# Altium project Motherboard.PrjPcb (part 2 of 2)

## Sheet USB.SchDoc: Ethernet PHY with RJ45 connector
size A3; Date: Not used; ApprovedBy: Not used; CheckedBy: Not used; Author: Not used; CompanyName: STMicroelectronics; DrawnBy: Not used; Engineer: Not used; Organization: Not used; Address1: Not used; Address2: Not used; Address3: Not used; Address4: Not used; DocumentNumber: 6; Revision: Not used; SheetNumber: 6; SheetTotal: 9; Time: Not used; ImagePath: Not used; Application_BuildNumber: Not used
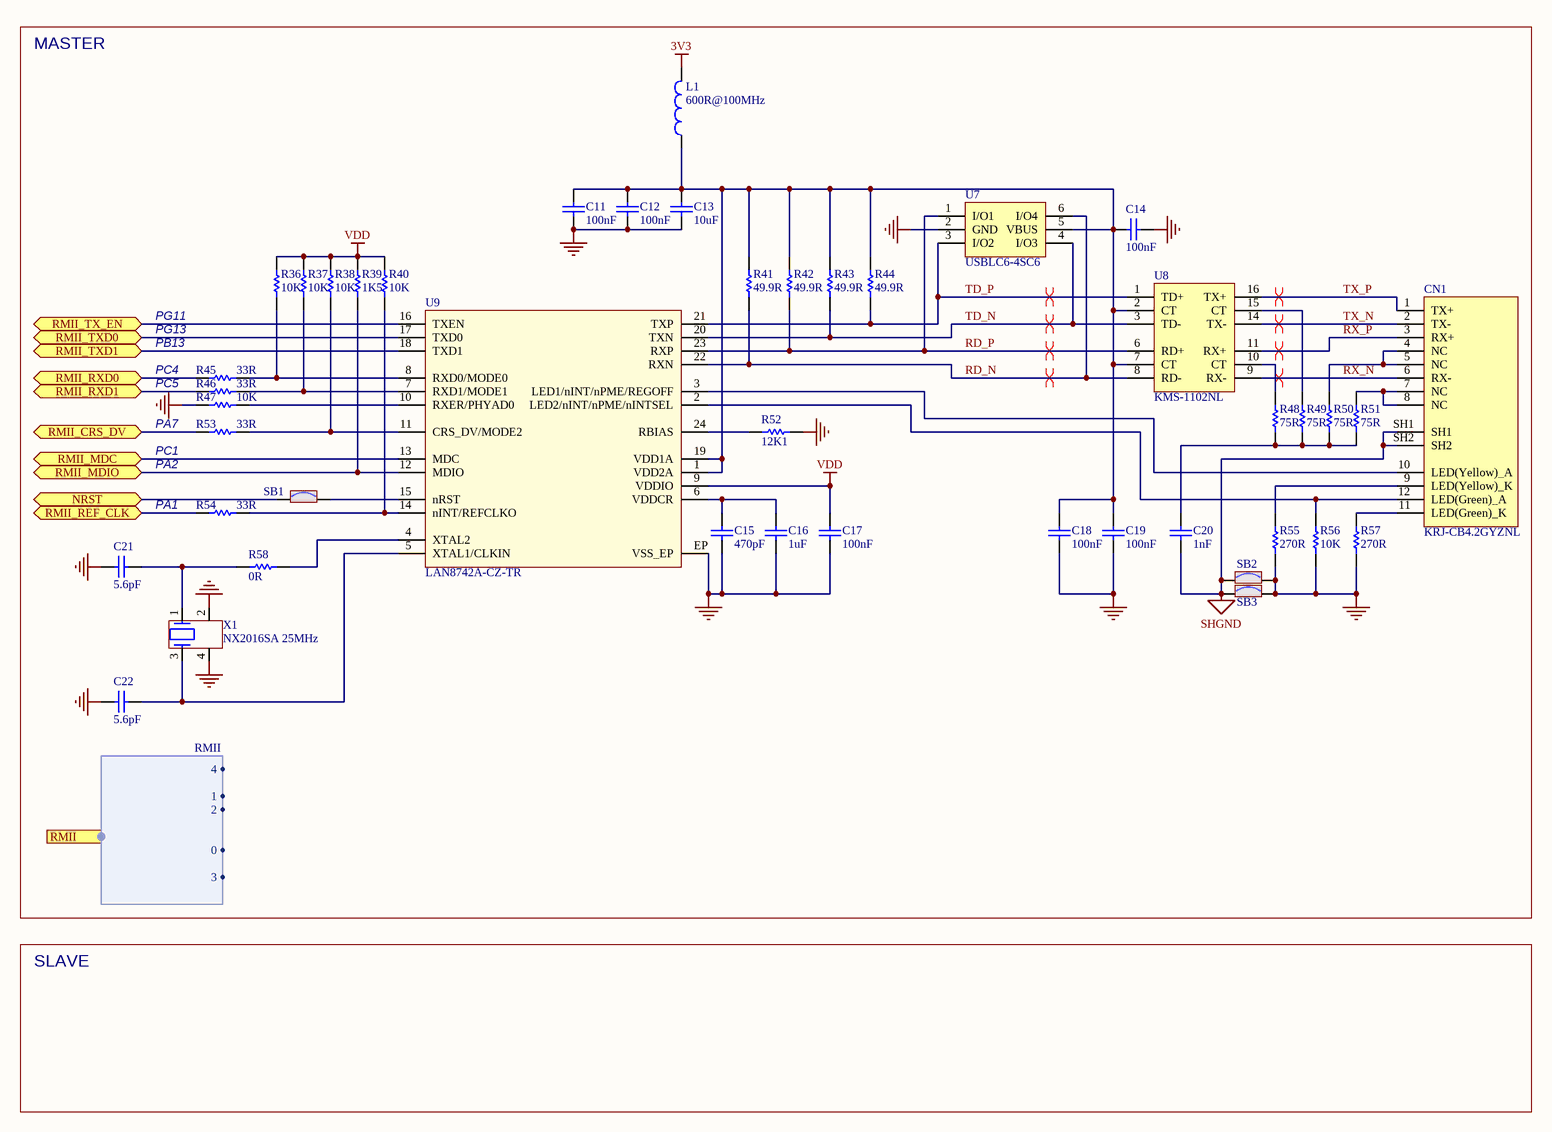
[diagram p5: USB.SchDoc]

### Parts
(Parts that share a designator on the sheet are numbered #1, #2 ... from top to bottom, then left to right.)
C11  value 100nF  [C0603]  (hidden comment: Capacitor)
C12  value 100nF  [C0603]  (hidden comment: Capacitor)
C13  value 10uF  [C0603]  (hidden comment: Capacitor)
C14  value 100nF  [C0603]  (hidden comment: Capacitor)
C15  value 470pF  [C0402]  (hidden comment: Capacitor)
C16  value 1uF  [C0402]  (hidden comment: Capacitor)
C17  value 100nF  [C0603]  (hidden comment: Capacitor)
C18  value 100nF  [C0603]  (hidden comment: Capacitor)
C19  value 100nF  [C0603]  (hidden comment: Capacitor)
C20  value 1nF  [C1206_H1P6]  (hidden comment: Capacitor)
C21  value 5.6pF  [C0402]  (hidden comment: Capacitor)
C22  value 5.6pF  [C0402]  (hidden comment: Capacitor)
CN1  value KRJ-CB4.2GYZNL  [CON_RJ45_DGKYD_KRJ-CB4.2GYZNL]  (hidden comment: RJ45_KRJ-CB4.2GYZNL)
L1#1  value 600R@100MHz  [L0603]  (hidden comment: BEAD)
R36  value 10K  [R0402]  (hidden comment: Resistor)
R37  value 10K  [R0402]  (hidden comment: Resistor)
R38  value 10K  [R0402]  (hidden comment: Resistor)
R39  value 1K5  [R0402]  (hidden comment: Resistor)
R40#1  value 10K  [R0402]  (hidden comment: Resistor)
R41#1  value 49.9R  [R0402]  (hidden comment: Resistor)
R42#1  value 49.9R  [R0402]  (hidden comment: Resistor)
R43#1  value 49.9R  [R0402]  (hidden comment: Resistor)
R44#1  value 49.9R  [R0402]  (hidden comment: Resistor)
R45#1  value 33R  [R0402]  (hidden comment: Resistor)
R46#1  value 33R  [R0402]  (hidden comment: Resistor)
R47#1  value 10K  [R0402]  (hidden comment: Resistor)
R48#1  value 75R  [R0402]  (hidden comment: Resistor)
R49#1  value 75R  [R0402]  (hidden comment: Resistor)
R50#1  value 75R  [R0402]  (hidden comment: Resistor)
R51#1  value 75R  [R0402]  (hidden comment: Resistor)
R52#1  value 12K1  [R0402]  (hidden comment: Resistor)
R53#1  value 33R  [R0402]  (hidden comment: Resistor)
R54#1  value 33R  [R0402]  (hidden comment: Resistor)
R55#1  value 270R  [R0402]  (hidden comment: Resistor)
R56  value 10K  [R0402]  (hidden comment: Resistor)
R57#1  value 270R  [R0402]  (hidden comment: Resistor)
R58#1  value 0R  [R0402]  (hidden comment: Resistor)
SB1  SB_ON  [SOLDER-BRIDGE_R0603-0R]  (value not drawn)
SB2  SB_ON  [SOLDER-BRIDGE_R0603-0R]  (value not drawn)
SB3  SB_ON  [SOLDER-BRIDGE_R0603-0R]  (value not drawn)
U7  USBLC6-4SC6  [ESD_SOT23-6L]
U8  KMS-1102NL  [TRS_DGKYD_KMS-1102NL]
U9  LAN8742A-CZ-TR  [ICC_VQFN24-EPAD_4X4_P050]
X1  value NX2016SA 25MHz  [CRY_NX2016SA_4P]  (hidden comment: XTAL_4_PINS)

### Ports
NRST (bidir), RMII (harness RMII), RMII_CRS_DV (bidir), RMII_MDC (bidir), RMII_MDIO (bidir), RMII_REF_CLK (bidir), RMII_RXD0 (bidir), RMII_RXD1 (bidir), RMII_TX_EN (bidir), RMII_TXD0 (bidir), RMII_TXD1 (bidir)

### Harnesses
RMII: 0, 1, 2, 3, 4

### Nets
3V3: L1#1.2
GND: C11.1 C12.1 C13.1 C14.2 C15.1 C16.1 C17.1 C18.1 C19.1 C21.1 C22.1 R47#1.2 R52#1.2 R55#1.1 R56.1 R57#1.1 SB2.2 SB3.2 U7.2(GND) U9.EP(VSS_EP) X1.2 X1.4
SHGND: C20.1 CN1.SH1 CN1.SH2 SB2.1 SB3.1
VDD: C17.2 R36.2 R37.2 R38.2 R39.2 R40#1.2 U9.9(VDDIO)
RD_N: R41#1.1 U7.6(I/O4) U8.8(RD-) U9.22(RXN)
RD_P: R42#1.1 U7.1(I/O1) U8.6(RD+) U9.23(RXP)
RX_N: CN1.6(RX-) U8.9(RX-)
RX_P: CN1.3(RX+) U8.11(RX+)
TD_N: R43#1.1 U7.4(I/O3) U8.3(TD-) U9.20(TXN)
TD_P: R44#1.1 U7.3(I/O2) U8.1(TD+) U9.21(TXP)
TX_N: CN1.2(TX-) U8.14(TX-)
TX_P: CN1.1(TX+) U8.16(TX+)
NetC11_2: C11.2 C12.2 C13.2 C14.1 C18.2 C19.2 L1#1.1 R41#1.2 R42#1.2 R43#1.2 R44#1.2 U7.5(VBUS) U8.2(CT) U8.7(CT) U9.1(VDD2A) U9.19(VDD1A)
NetC15_2: C15.2 C16.2 U9.6(VDDCR)
NetC20_2: C20.2 R48#1.1 R49#1.1 R50#1.1 R51#1.1
NetC21_2: C21.2 R58#1.1 X1.1
NetC22_2: C22.2 U9.5(XTAL1/CLKIN) X1.3
NetCN1_4: CN1.4(NC) CN1.5(NC) R50#1.2
NetCN1_7: CN1.7(NC) CN1.8(NC) R51#1.2
NetCN1_9: CN1.9(LED(Yellow)_K) R55#1.2
NetCN1_10: CN1.10(LED(Yellow)_A) U9.3(LED1/nINT/nPME/REGOFF)
NetCN1_11: CN1.11(LED(Green)_K) R57#1.2
NetCN1_12: CN1.12(LED(Green)_A) R56.2 U9.2(LED2/nINT/nPME/nINTSEL)
NetR36_1: R36.1 R45#1.2 U9.8(RXD0/MODE0)
NetR37_1: R37.1 R46#1.2 U9.7(RXD1/MODE1)
NetR38_1: R38.1 R53#1.2 U9.11(CRS_DV/MODE2)
NetR39_1: R39.1 U9.12(MDIO) ; port RMII_MDIO
NetR40#1_1: R40#1.1 R54#1.2 U9.14(nINT/REFCLKO)
NetR41#2_1: R53#1.1 ; port RMII_CRS_DV
NetR44#2_1: R45#1.1 ; port RMII_RXD0
NetR45#2_1: R46#1.1 ; port RMII_RXD1
NetR47#1_1: R47#1.1 U9.10(RXER/PHYAD0)
NetR48#1_2: R48#1.2 U8.10(CT)
NetR49#1_2: R49#1.2 U8.15(CT)
NetR49#2_1: R54#1.1 ; port RMII_REF_CLK
NetR52#1_1: R52#1.1 U9.24(RBIAS)
NetR58#1_2: R58#1.2 U9.4(XTAL2)
NetSB1_1: SB1.1 ; port NRST
NetSB1_2: SB1.2 U9.15(nRST)
NetU9_13: U9.13(MDC) ; port RMII_MDC
NetU9_16: U9.16(TXEN) ; port RMII_TX_EN
NetU9_17: U9.17(TXD0) ; port RMII_TXD0
NetU9_18: U9.18(TXD1) ; port RMII_TXD1

### Layout directives
differential pair: RD_N, RD_P, RX_N, RX_P, TD_N, TD_P, TX_N, TX_P

### Notes on the sheet
- MASTER
- PG11
- PG13
- PB13
- PC4
- PC5
- PA7
- PC1
- PA2
- (near R54#1) PA1
- SLAVE
- Title
- Size:
- Date:
- A3
- Number:
- Time:
- Revision:
- Sheet
- of
- File:

### Library data of the parts
C11 C12 C14 C17-C19 = MCD-00237: Capacitor, MLCC, 100nF, 6V3, X5R, 10%, 0603, T=0,8mm; Manufacturer_Part_Number: CC0603KRX5R5BB104; Manufacturer: YAGEO; Provided_By: SUBCO; ECCN_US: EAR99; ECCN_EU: NEC; Internal_Part_Number: MCD-00237; Status: Released; Part_Type: Capacitor; Package: C0603; ComponentLink1Description: Datasheet; ComponentLink1URL: http://tunmcdsvn.tun.st.com/Component_Datasheet_Library/Trunk/Capacitors/Yageo_Multilayer_capacitor_X5R_series_100pF_to_100uF
C13 = MCD-01124: Capacitor, MLCC, 10µF, 10V, X5R, 10%, 0603, T=0.8mm; Manufacturer_Part_Number: GRM188R61A106KAAL; Manufacturer: MURATA; Provided_By: SUBCO; ECCN_US: EAR99; ECCN_EU: NEC; Internal_Part_Number: MCD-01124; Status: Released; Part_Type: Capacitor; Package: C0603; ComponentLink1Description: Datasheet; ComponentLink1URL: http://tunmcdsvn.tun.st.com/Component_Datasheet_Library/Trunk/Capacitors/Murata_Capacitor_GR_series
C15 = MCD-00724: Capacitor, MLCC, 470pF, 50V, NPO, 5%, 0402, T=0,5mm; Manufacturer_Part_Number: CC0402JRNPO9BN471; Manufacturer: YAGEO; Provided_By: SUBCO; Internal_Part_Number: MCD-00724; Status: Released; Part_Type: Capacitor; Package: C0402; ComponentLink1Description: Datasheet; ComponentLink1URL: http://tunmcdsvn.tun.st.com/Component_Datasheet_Library/Trunk/Capacitors/Yageo_Capacitor_NP0_16V-to-50V; ECCN_US: N/A; ECCN_EU: N/A
C16 = MCD-00095: Capacitor, MLCC, 1uF, 6V3, X5R, 10%, 0402, T=0,5mm; Manufacturer_Part_Number: GRM155R61E105KA12; Manufacturer: MURATA; Alternate_Manufacturer_Part_Number: GRM155R60J105KE19; Provided_By: SUBCO; ECCN_US: EAR99; ECCN_EU: NEC; Internal_Part_Number: MCD-00095; Status: Released; Part_Type: Capacitor; Package: C0402; ComponentLink1Description: Datasheet; ComponentLink1URL: http://tunmcdsvn.tun.st.com/Component_Datasheet_Library/Trunk/Capacitors/Murata_Capacitor_GR_series; Alternate_Manufacturer: MURATA
C20 = MCD-00722: Capacitor, MLCC, 1nF, 2KV, X7R, 10%, 1206, T=1,25mm; Manufacturer_Part_Number: CC1206KKX7RDBB102; Manufacturer: YAGEO; Provided_By: SUBCO; Internal_Part_Number: MCD-00722; Status: Released; Part_Type: Capacitor; Package: C1206; ComponentLink1Description: Datasheet; ComponentLink1URL: http://tunmcdsvn.tun.st.com/Component_Datasheet_Library/Trunk/Capacitors/Yageo_Multilayer_Capacitor_NPO_X7R_1KV_to_3KV_10pF_to_33nF/; ECCN_US: N/A; ECCN_EU: N/A
C21 C22 = MCD-01374: Capacitor, MLCC, 5.6pF, 50V, NPO, 5%, 0402, T=0,5mm; Manufacturer_Part_Number: CC0402BRNPO9BN5R6; Manufacturer: YAGEO; Provided_By: SUBCO; Internal_Part_Number: MCD-01374; Status: Released; Part_Type: Capacitor; Package: C0402; ComponentLink1Description: Datasheet; ComponentLink1URL: http://tunmcdsvn.tun.st.com/Component_Datasheet_Library/Trunk/Capacitors/Yageo_Capacitor_NP0_16V-to-50V; ECCN_US: N/A; ECCN_EU: N/A
CN1 = MCD-00717: RJ45 jack, single port, with LEDS, Metal shielded dip low profile; Part_Type: Connector; Manufacturer: DONGGUAN KEYOUDA ELECTRONIC TECHNOLOGY; Provided_By: SUBCO; Internal_Part_Number: MCD-00717; Status: Released; Manufacturer_Part_Number: KRJ-CB4.2GYZNL; ComponentLink1Description: Datasheet; ComponentLink1URL: http://tunmcdsvn.tun.st.com/Component_Datasheet_Library/Trunk/Connectors/DGKYD_RJ45_KRJ-CB4.2GYZNL; ECCN_US: n/a; ECCN_EU: n/a
L1#1 = MCD-00047: SMD Chip ferrite bead, 600R@100MHz +/-25%, 350mA, 500mohm DC, 0603, T=0.8mm; Part_Type: Inductor; Manufacturer_Part_Number: FCM1608KF-601T03; Manufacturer: TAI-TECH; Provided_By: SUBCO; Internal_Part_Number: MCD-00047; Status: Released; ComponentLink1Description: Datasheet; ComponentLink1URL: http://tunmcdsvn.tun.st.com/Component_Datasheet_Library/Trunk/Inductors/TaiTech_Bead_FCM1608_series; ECCN_US: n/a; ECCN_EU: n/a
R36-R38 R40#1 R47#1 R56 = MCD-00053: Resistor,10K,0402,1%,1/16W; Manufacturer_Part_Number: RC0402FR-0710KL; Manufacturer: YAGEO; Provided_By: SUBCO; ECCN_US: EAR99; ECCN_EU: NEC; Internal_Part_Number: MCD-00053; Status: Released; Part_Type: Resistor; Package: R0402; ComponentLink1Description: Datasheet; ComponentLink1URL: http://tunmcdsvn.tun.st.com/Component_Datasheet_Library/Trunk/Resistors/Yageo_Resistor_RC0402-series
R39 = MCD-00068: Resistor,1K5,0402,1%,1/16W; Manufacturer_Part_Number: RC0402FR-071K5L; Manufacturer: YAGEO; Provided_By: SUBCO; ECCN_US: EAR99; ECCN_EU: NEC; Internal_Part_Number: MCD-00068; Status: Released; Part_Type: Resistor; Package: R0402; ComponentLink1Description: Datasheet; ComponentLink1URL: http://tunmcdsvn.tun.st.com/Component_Datasheet_Library/Trunk/Resistors/Yageo_Resistor_RC0402-series
R41#1 R42#1 R43#1 R44#1 = MCD-00565: Resistor,49R9,0402,1%,1/16W; Manufacturer_Part_Number: RC0402FR-0749R9L; Manufacturer: YAGEO; Provided_By: SUBCO; ECCN_US: EAR99; ECCN_EU: NEC; Internal_Part_Number: MCD-00565; Status: Released; Part_Type: Resistor; Package: R0402; ComponentLink1Description: Datasheet; ComponentLink1URL: http://tunmcdsvn.tun.st.com/Component_Datasheet_Library/Trunk/Resistors/Yageo_Resistor_RC0402-series
R45#1 R46#1 R53#1 R54#1 = MCD-00455: Resistor,33R,0402,1%,1/16W; Manufacturer_Part_Number: RC0402FR-0733RL; Manufacturer: YAGEO; Provided_By: SUBCO; ECCN_US: EAR99; ECCN_EU: NEC; Internal_Part_Number: MCD-00455; Status: Released; Part_Type: Resistor; Package: R0402; ComponentLink1Description: Datasheet; ComponentLink1URL: http://tunmcdsvn.tun.st.com/Component_Datasheet_Library/Trunk/Resistors/Yageo_Resistor_RC0402-series
R48#1 R49#1 R50#1 R51#1 = MCD-00515: Resistor,75R,0402,1%,1/16W; Manufacturer_Part_Number: RC0402FR-0775RL; Manufacturer: YAGEO; Provided_By: SUBCO; ECCN_US: EAR99; ECCN_EU: NEC; Internal_Part_Number: MCD-00515; Status: Released; Part_Type: Resistor; Package: R0402; ComponentLink1Description: Datasheet; ComponentLink1URL: http://tunmcdsvn.tun.st.com/Component_Datasheet_Library/Trunk/Resistors/Yageo_Resistor_RC0402-series
R52#1 = MCD-00723: Resistor,12K1,0402,1%,1/16W; Manufacturer_Part_Number: RC0402FR-0712K1L; Manufacturer: YAGEO; Provided_By: SUBCO; ECCN_US: EAR99; ECCN_EU: NEC; Internal_Part_Number: MCD-00723; Status: Released; Part_Type: Resistor; Package: R0402; ComponentLink1Description: Datasheet; ComponentLink1URL: http://tunmcdsvn.tun.st.com/Component_Datasheet_Library/Trunk/Resistors/Yageo_Resistor_RC0402-series
R55#1 R57#1 = MCD-00441: Resistor,270R,0402,1%,1/16W; Manufacturer_Part_Number: RC0402FR-07270RL; Manufacturer: YAGEO; Provided_By: SUBCO; ECCN_US: EAR99; ECCN_EU: NEC; Internal_Part_Number: MCD-00441; Status: Released; Part_Type: Resistor; Package: R0402; ComponentLink1Description: Datasheet; ComponentLink1URL: http://tunmcdsvn.tun.st.com/Component_Datasheet_Library/Trunk/Resistors/Yageo_Resistor_RC0402-series
R58#1 = MCD-00052: Resistor,0R,0402,5%,1/16W; Manufacturer_Part_Number: RC0402JR-070RL; Manufacturer: YAGEO; Provided_By: SUBCO; ECCN_US: EAR99; ECCN_EU: NEC; Internal_Part_Number: MCD-00052; Status: Released; Part_Type: Resistor; Package: R0402; ComponentLink1Description: Datasheet; ComponentLink1URL: http://tunmcdsvn.tun.st.com/Component_Datasheet_Library/Trunk/Resistors/Yageo_Resistor_RC0402-series
SB1-SB3 = MCD-00071: Solder Bridge ON; Part_Type: Mechanical; Manufacturer_Part_Number: RC0603JR-070RL; Manufacturer: YAGEO; Provided_By: SUBCO; Internal_Part_Number: MCD-00071; Status: Released; ComponentLink1Description: Datasheet; Package: SB0603; ComponentLink1URL: http://tunmcdsvn.tun.st.com/Component_Datasheet_Library/Trunk/Resistors/Yageo_Resistor_RC0603-series; ECCN_US: n/a; ECCN_EU: n/a
U7 = MCD-00250: Very low capacitance ESD protection , 4 lines; Part_Type: IC; Manufacturer: STMICROELECTRONICS; BMS_Part_Number: 9151001; Provided_By: SUBCO with ST control; ECCN_US: EAR99; ECCN_EU: NEC; Internal_Part_Number: MCD-00250; Value: USBLC6-4SC6; Status: Released; Manufacturer_Part_Number: USBLC6-4SC6; ComponentLink1Description: Datasheet; ComponentLink1URL: http://tunmcdsvn.tun.st.com/Component_Datasheet_Library/Trunk/Diodes/STM_ESD_USBLC6-4SC6
U8 = MCD-00718: Discrete Magnetic Transformer Module, 16 pins, SMT, 100 Base-TX; Part_Type: IC; Manufacturer: DONGGUAN KEYOUDA ELECTRONIC TECHNOLOGY; Provided_By: SUBCO; Internal_Part_Number: MCD-00718; Value: KMS-1102NL; Status: Released; Manufacturer_Part_Number: KMS-1102NL; ComponentLink1Description: Datasheet; ComponentLink1URL: http://tunmcdsvn.tun.st.com/Component_Datasheet_Library/Trunk/IC/DGKYD_KMS-1102NL; ECCN_US: n/a; ECCN_EU: n/a
U9 = MCD-00719: 10/100M RMII Ethernet transceiver; Part_Type: IC; Manufacturer: MICROCHIP; Provided_By: SUBCO; Internal_Part_Number: MCD-00719; Value: LAN8742A-CZ-TR; Status: Released; Manufacturer_Part_Number: LAN8742A-CZ-TR; ComponentLink1Description: Datasheet; ComponentLink1URL: http://tunmcdsvn.tun.st.com/Component_Datasheet_Library/Trunk/IC/MICROCHIP_LAN8742A_RMII_PHY; ECCN_US: n/a; ECCN_EU: n/a
X1 = MCD-01364: Crystal 25MHz, 6pF, +-20ppm, 80ohms max, SMD; Part_Type: Crystal_Osc; Manufacturer_Part_Number: NX2016SA 25MHz EXS00A-CS11321; Manufacturer: NDK; BMS_Part_Number: 9157044; Provided_By: SUBCO; ECCN_US: EAR99; ECCN_EU: NEC; Internal_Part_Number: MCD-01364; Status: Released; Package: NX2016SA; ComponentLink1Description: Datasheet; ComponentLink1URL: http://tunmcdsvn.tun.st.com/Component_Datasheet_Library/Trunk/Crystal_Osc/NDK_NX2016SA 25MHz EXS00A-CS11321 (EXS10B-28187); Order_Code_Digikey: 644-1367

## Sheet RS-485.SchDoc: Ethernet PHY with RJ45 connector
size A2; Date: Not used; ApprovedBy: Not used; CheckedBy: Not used; Author: Not used; CompanyName: STMicroelectronics; DrawnBy: Not used; Engineer: Not used; Organization: Not used; Address1: Not used; Address2: Not used; Address3: Not used; Address4: Not used; DocumentNumber: 6; Revision: Not used; SheetNumber: 6; SheetTotal: 9; Time: Not used; ImagePath: Not used; Application_BuildNumber: Not used
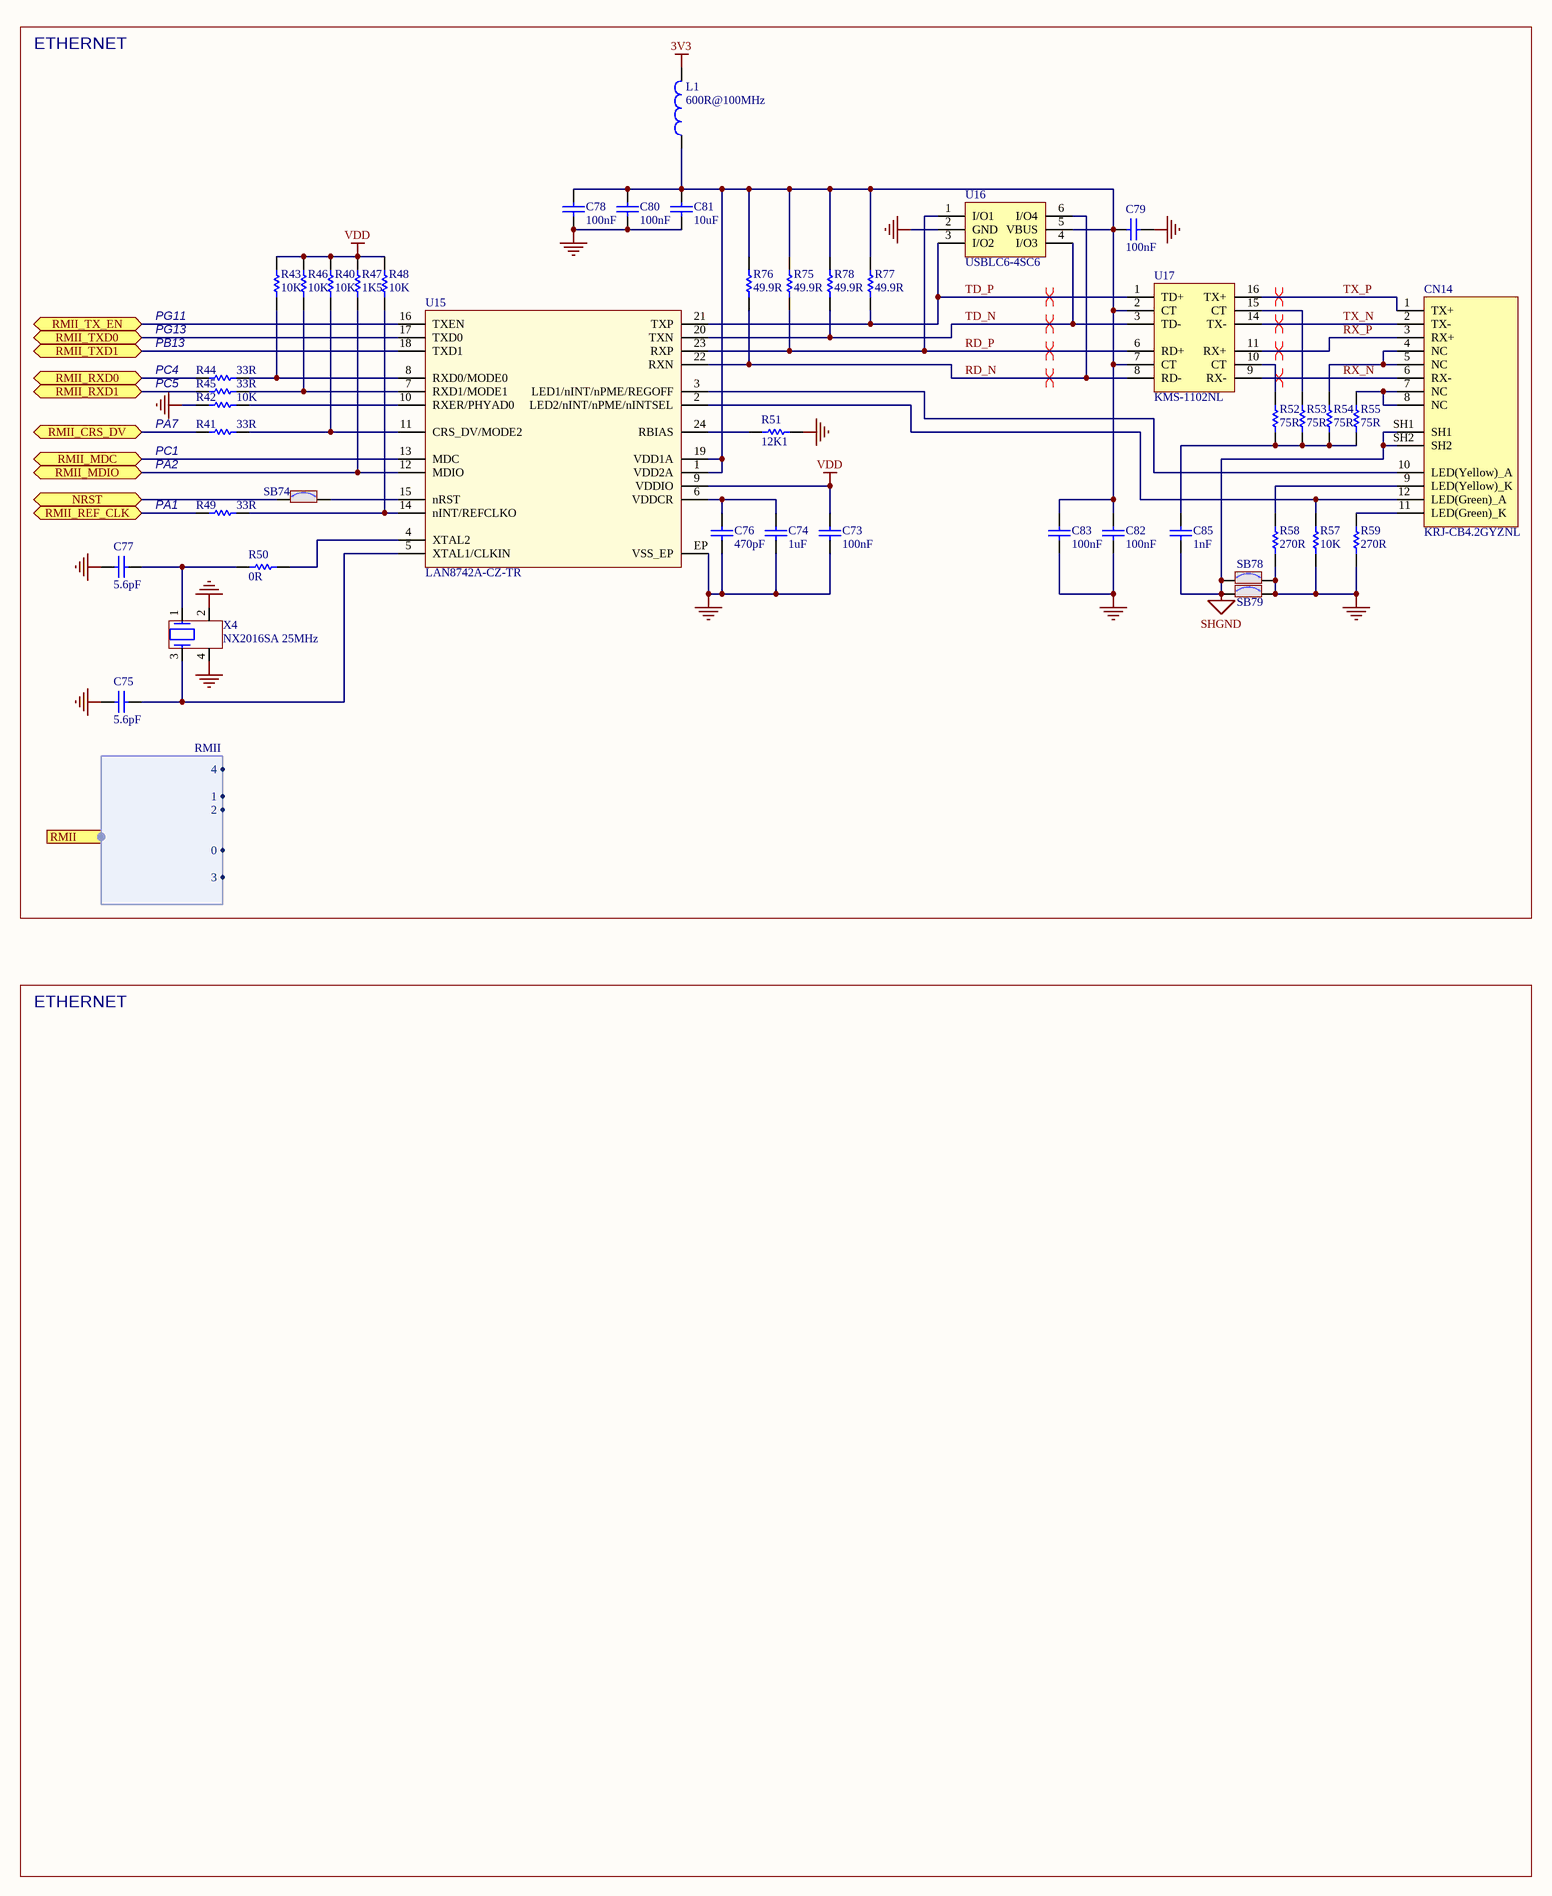
[diagram p6: RS-485.SchDoc]

### Parts
(Parts that share a designator on the sheet are numbered #1, #2 ... from top to bottom, then left to right.)
C73  value 100nF  [C0603]  (hidden comment: Capacitor)
C74  value 1uF  [C0402]  (hidden comment: Capacitor)
C75  value 5.6pF  [C0402]  (hidden comment: Capacitor)
C76  value 470pF  [C0402]  (hidden comment: Capacitor)
C77  value 5.6pF  [C0402]  (hidden comment: Capacitor)
C78  value 100nF  [C0603]  (hidden comment: Capacitor)
C79  value 100nF  [C0603]  (hidden comment: Capacitor)
C80  value 100nF  [C0603]  (hidden comment: Capacitor)
C81  value 10uF  [C0603]  (hidden comment: Capacitor)
C82  value 100nF  [C0603]  (hidden comment: Capacitor)
C83  value 100nF  [C0603]  (hidden comment: Capacitor)
C85  value 1nF  [C1206_H1P6]  (hidden comment: Capacitor)
CN14  value KRJ-CB4.2GYZNL  [CON_RJ45_DGKYD_KRJ-CB4.2GYZNL]  (hidden comment: RJ45_KRJ-CB4.2GYZNL)
L1#2  value 600R@100MHz  [L0603]  (hidden comment: BEAD)
R40#2  value 10K  [R0402]  (hidden comment: Resistor)
R41#2  value 33R  [R0402]  (hidden comment: Resistor)
R42#2  value 10K  [R0402]  (hidden comment: Resistor)
R43#2  value 10K  [R0402]  (hidden comment: Resistor)
R44#2  value 33R  [R0402]  (hidden comment: Resistor)
R45#2  value 33R  [R0402]  (hidden comment: Resistor)
R46#2  value 10K  [R0402]  (hidden comment: Resistor)
R47#2  value 1K5  [R0402]  (hidden comment: Resistor)
R48#2  value 10K  [R0402]  (hidden comment: Resistor)
R49#2  value 33R  [R0402]  (hidden comment: Resistor)
R50#2  value 0R  [R0402]  (hidden comment: Resistor)
R51#2  value 12K1  [R0402]  (hidden comment: Resistor)
R52#2  value 75R  [R0402]  (hidden comment: Resistor)
R53#2  value 75R  [R0402]  (hidden comment: Resistor)
R54#2  value 75R  [R0402]  (hidden comment: Resistor)
R55#2  value 75R  [R0402]  (hidden comment: Resistor)
R57#2  value 10K  [R0402]  (hidden comment: Resistor)
R58#2  value 270R  [R0402]  (hidden comment: Resistor)
R59  value 270R  [R0402]  (hidden comment: Resistor)
R75  value 49.9R  [R0402]  (hidden comment: Resistor)
R76  value 49.9R  [R0402]  (hidden comment: Resistor)
R77  value 49.9R  [R0402]  (hidden comment: Resistor)
R78  value 49.9R  [R0402]  (hidden comment: Resistor)
SB74  SB_ON  [SOLDER-BRIDGE_R0603-0R]  (value not drawn)
SB78  SB_ON  [SOLDER-BRIDGE_R0603-0R]  (value not drawn)
SB79  SB_ON  [SOLDER-BRIDGE_R0603-0R]  (value not drawn)
U15  LAN8742A-CZ-TR  [ICC_VQFN24-EPAD_4X4_P050]
U16  USBLC6-4SC6  [ESD_SOT23-6L]
U17  KMS-1102NL  [TRS_DGKYD_KMS-1102NL]
X4  value NX2016SA 25MHz  [CRY_NX2016SA_4P]  (hidden comment: XTAL_4_PINS)

### Ports
NRST (bidir), RMII (harness RMII), RMII_CRS_DV (bidir), RMII_MDC (bidir), RMII_MDIO (bidir), RMII_REF_CLK (bidir), RMII_RXD0 (bidir), RMII_RXD1 (bidir), RMII_TX_EN (bidir), RMII_TXD0 (bidir), RMII_TXD1 (bidir)

### Harnesses
RMII: 0, 1, 2, 3, 4

### Nets
3V3: L1#2.2
GND: C73.1 C74.1 C75.1 C76.1 C77.1 C78.1 C79.2 C80.1 C81.1 C82.1 C83.1 R42#2.2 R51#2.2 R57#2.1 R58#2.1 R59.1 SB78.2 SB79.2 U15.EP(VSS_EP) U16.2(GND) X4.2 X4.4
SHGND: C85.1 CN14.SH1 CN14.SH2 SB78.1 SB79.1
VDD: C73.2 R40#2.2 R43#2.2 R46#2.2 R47#2.2 R48#2.2 U15.9(VDDIO)
RD_N: R76.1 U15.22(RXN) U16.6(I/O4) U17.8(RD-)
RD_P: R75.1 U15.23(RXP) U16.1(I/O1) U17.6(RD+)
RX_N: CN14.6(RX-) U17.9(RX-)
RX_P: CN14.3(RX+) U17.11(RX+)
TD_N: R78.1 U15.20(TXN) U16.4(I/O3) U17.3(TD-)
TD_P: R77.1 U15.21(TXP) U16.3(I/O2) U17.1(TD+)
TX_N: CN14.2(TX-) U17.14(TX-)
TX_P: CN14.1(TX+) U17.16(TX+)
NetC74_2: C74.2 C76.2 U15.6(VDDCR)
NetC75_2: C75.2 U15.5(XTAL1/CLKIN) X4.3
NetC77_2: C77.2 R50#2.1 X4.1
NetC78_2: C78.2 C79.1 C80.2 C81.2 C82.2 C83.2 L1#2.1 R75.2 R76.2 R77.2 R78.2 U15.1(VDD2A) U15.19(VDD1A) U16.5(VBUS) U17.2(CT) U17.7(CT)
NetC85_2: C85.2 R52#2.1 R53#2.1 R54#2.1 R55#2.1
NetCN14_4: CN14.4(NC) CN14.5(NC) R54#2.2
NetCN14_7: CN14.7(NC) CN14.8(NC) R55#2.2
NetCN14_9: CN14.9(LED(Yellow)_K) R58#2.2
NetCN14_10: CN14.10(LED(Yellow)_A) U15.3(LED1/nINT/nPME/REGOFF)
NetCN14_11: CN14.11(LED(Green)_K) R59.2
NetCN14_12: CN14.12(LED(Green)_A) R57#2.2 U15.2(LED2/nINT/nPME/nINTSEL)
NetR39_1: R47#2.1 U15.12(MDIO) ; port RMII_MDIO
NetR40#2_1: R40#2.1 R41#2.2 U15.11(CRS_DV/MODE2)
NetR41#2_1: R41#2.1 ; port RMII_CRS_DV
NetR42#2_1: R42#2.1 U15.10(RXER/PHYAD0)
NetR43#2_1: R43#2.1 R44#2.2 U15.8(RXD0/MODE0)
NetR44#2_1: R44#2.1 ; port RMII_RXD0
NetR45#2_1: R45#2.1 ; port RMII_RXD1
NetR45#2_2: R45#2.2 R46#2.1 U15.7(RXD1/MODE1)
NetR48#2_1: R48#2.1 R49#2.2 U15.14(nINT/REFCLKO)
NetR49#2_1: R49#2.1 ; port RMII_REF_CLK
NetR50#2_2: R50#2.2 U15.4(XTAL2)
NetR51#2_1: R51#2.1 U15.24(RBIAS)
NetR52#2_2: R52#2.2 U17.10(CT)
NetR53#2_2: R53#2.2 U17.15(CT)
NetSB1_1: SB74.1 ; port NRST
NetSB74_2: SB74.2 U15.15(nRST)
NetU9_13: U15.13(MDC) ; port RMII_MDC
NetU9_16: U15.16(TXEN) ; port RMII_TX_EN
NetU9_17: U15.17(TXD0) ; port RMII_TXD0
NetU9_18: U15.18(TXD1) ; port RMII_TXD1

### Layout directives
differential pair: RD_N, RD_P, RX_N, RX_P, TD_N, TD_P, TX_N, TX_P

### Notes on the sheet
- ETHERNET
- PG11
- PG13
- PB13
- PC4
- PC5
- PA7
- PC1
- PA2
- (near R49#2) PA1
- Title
- Size:
- Date:
- File:
- A2
- Number:
- Time:
- Revision:
- Sheet
- of

### Library data of the parts
C73 C78-C80 C82 C83 = MCD-00237: as C11 on sheet USB; Internal_Part_Number: MCD-00237; Status: Released; Part_Type: Capacitor; Package: C0603; ComponentLink1Description: Datasheet; ComponentLink1URL: http://tunmcdsvn.tun.st.com/Component_Datasheet_Library/Trunk/Capacitors/Yageo_Multilayer_capacitor_X5R_series_100pF_to_100uF
C74 = MCD-00095: as C16 on sheet USB; Internal_Part_Number: MCD-00095; Status: Released; Part_Type: Capacitor; Package: C0402; ComponentLink1Description: Datasheet; ComponentLink1URL: http://tunmcdsvn.tun.st.com/Component_Datasheet_Library/Trunk/Capacitors/Murata_Capacitor_GR_series; Alternate_Manufacturer: MURATA
C75 C77 = MCD-01374: as C21 on sheet USB; Internal_Part_Number: MCD-01374; Status: Released; Part_Type: Capacitor; Package: C0402; ComponentLink1Description: Datasheet; ComponentLink1URL: http://tunmcdsvn.tun.st.com/Component_Datasheet_Library/Trunk/Capacitors/Yageo_Capacitor_NP0_16V-to-50V; ECCN_US: N/A; ECCN_EU: N/A
C76 = MCD-00724: as C15 on sheet USB; Internal_Part_Number: MCD-00724; Status: Released; Part_Type: Capacitor; Package: C0402; ComponentLink1Description: Datasheet; ComponentLink1URL: http://tunmcdsvn.tun.st.com/Component_Datasheet_Library/Trunk/Capacitors/Yageo_Capacitor_NP0_16V-to-50V; ECCN_US: N/A; ECCN_EU: N/A
C81 = MCD-01124: as C13 on sheet USB; Internal_Part_Number: MCD-01124; Status: Released; Part_Type: Capacitor; Package: C0603; ComponentLink1Description: Datasheet; ComponentLink1URL: http://tunmcdsvn.tun.st.com/Component_Datasheet_Library/Trunk/Capacitors/Murata_Capacitor_GR_series
C85 = MCD-00722: as C20 on sheet USB; Internal_Part_Number: MCD-00722; Status: Released; Part_Type: Capacitor; Package: C1206; ComponentLink1Description: Datasheet; ComponentLink1URL: http://tunmcdsvn.tun.st.com/Component_Datasheet_Library/Trunk/Capacitors/Yageo_Multilayer_Capacitor_NPO_X7R_1KV_to_3KV_10pF_to_33nF/; ECCN_US: N/A; ECCN_EU: N/A
CN14 = MCD-00717: as CN1 on sheet USB; Internal_Part_Number: MCD-00717; Status: Released; Manufacturer_Part_Number: KRJ-CB4.2GYZNL; ComponentLink1Description: Datasheet; ComponentLink1URL: http://tunmcdsvn.tun.st.com/Component_Datasheet_Library/Trunk/Connectors/DGKYD_RJ45_KRJ-CB4.2GYZNL; ECCN_US: n/a; ECCN_EU: n/a
L1#2 = MCD-00047: as L1#1 on sheet USB; Internal_Part_Number: MCD-00047; Status: Released; ComponentLink1Description: Datasheet; ComponentLink1URL: http://tunmcdsvn.tun.st.com/Component_Datasheet_Library/Trunk/Inductors/TaiTech_Bead_FCM1608_series; ECCN_US: n/a; ECCN_EU: n/a
R40#2 R42#2 R43#2 R46#2 R48#2 R57#2 = MCD-00053: as R36 on sheet USB; Internal_Part_Number: MCD-00053; Status: Released; Part_Type: Resistor; Package: R0402; ComponentLink1Description: Datasheet; ComponentLink1URL: http://tunmcdsvn.tun.st.com/Component_Datasheet_Library/Trunk/Resistors/Yageo_Resistor_RC0402-series
R41#2 R44#2 R45#2 R49#2 = MCD-00455: as R45#1 on sheet USB; Internal_Part_Number: MCD-00455; Status: Released; Part_Type: Resistor; Package: R0402; ComponentLink1Description: Datasheet; ComponentLink1URL: http://tunmcdsvn.tun.st.com/Component_Datasheet_Library/Trunk/Resistors/Yageo_Resistor_RC0402-series
R47#2 = MCD-00068: as R39 on sheet USB; Internal_Part_Number: MCD-00068; Status: Released; Part_Type: Resistor; Package: R0402; ComponentLink1Description: Datasheet; ComponentLink1URL: http://tunmcdsvn.tun.st.com/Component_Datasheet_Library/Trunk/Resistors/Yageo_Resistor_RC0402-series
R50#2 = MCD-00052: as R58#1 on sheet USB; Internal_Part_Number: MCD-00052; Status: Released; Part_Type: Resistor; Package: R0402; ComponentLink1Description: Datasheet; ComponentLink1URL: http://tunmcdsvn.tun.st.com/Component_Datasheet_Library/Trunk/Resistors/Yageo_Resistor_RC0402-series
R51#2 = MCD-00723: as R52#1 on sheet USB; Internal_Part_Number: MCD-00723; Status: Released; Part_Type: Resistor; Package: R0402; ComponentLink1Description: Datasheet; ComponentLink1URL: http://tunmcdsvn.tun.st.com/Component_Datasheet_Library/Trunk/Resistors/Yageo_Resistor_RC0402-series
R52#2 R53#2 R54#2 R55#2 = MCD-00515: as R48#1 on sheet USB; Internal_Part_Number: MCD-00515; Status: Released; Part_Type: Resistor; Package: R0402; ComponentLink1Description: Datasheet; ComponentLink1URL: http://tunmcdsvn.tun.st.com/Component_Datasheet_Library/Trunk/Resistors/Yageo_Resistor_RC0402-series
R58#2 R59 = MCD-00441: as R55#1 on sheet USB; Internal_Part_Number: MCD-00441; Status: Released; Part_Type: Resistor; Package: R0402; ComponentLink1Description: Datasheet; ComponentLink1URL: http://tunmcdsvn.tun.st.com/Component_Datasheet_Library/Trunk/Resistors/Yageo_Resistor_RC0402-series
R75-R78 = MCD-00565: as R41#1 on sheet USB; Internal_Part_Number: MCD-00565; Status: Released; Part_Type: Resistor; Package: R0402; ComponentLink1Description: Datasheet; ComponentLink1URL: http://tunmcdsvn.tun.st.com/Component_Datasheet_Library/Trunk/Resistors/Yageo_Resistor_RC0402-series
SB74 SB78 SB79 = MCD-00071: as SB1 on sheet USB; Internal_Part_Number: MCD-00071; Status: Released; ComponentLink1Description: Datasheet; Package: SB0603; ComponentLink1URL: http://tunmcdsvn.tun.st.com/Component_Datasheet_Library/Trunk/Resistors/Yageo_Resistor_RC0603-series; ECCN_US: n/a; ECCN_EU: n/a
U15 = MCD-00719: as U9 on sheet USB; Internal_Part_Number: MCD-00719; Value: LAN8742A-CZ-TR; Status: Released; Manufacturer_Part_Number: LAN8742A-CZ-TR; ComponentLink1Description: Datasheet; ComponentLink1URL: http://tunmcdsvn.tun.st.com/Component_Datasheet_Library/Trunk/IC/MICROCHIP_LAN8742A_RMII_PHY; ECCN_US: n/a; ECCN_EU: n/a
U16 = MCD-00250: as U7 on sheet USB; Internal_Part_Number: MCD-00250; Value: USBLC6-4SC6; Status: Released; Manufacturer_Part_Number: USBLC6-4SC6; ComponentLink1Description: Datasheet; ComponentLink1URL: http://tunmcdsvn.tun.st.com/Component_Datasheet_Library/Trunk/Diodes/STM_ESD_USBLC6-4SC6
U17 = MCD-00718: as U8 on sheet USB; Internal_Part_Number: MCD-00718; Value: KMS-1102NL; Status: Released; Manufacturer_Part_Number: KMS-1102NL; ComponentLink1Description: Datasheet; ComponentLink1URL: http://tunmcdsvn.tun.st.com/Component_Datasheet_Library/Trunk/IC/DGKYD_KMS-1102NL; ECCN_US: n/a; ECCN_EU: n/a
X4 = MCD-01364: as X1 on sheet USB; Internal_Part_Number: MCD-01364; Status: Released; Package: NX2016SA; ComponentLink1Description: Datasheet; ComponentLink1URL: http://tunmcdsvn.tun.st.com/Component_Datasheet_Library/Trunk/Crystal_Osc/NDK_NX2016SA 25MHz EXS00A-CS11321 (EXS10B-28187); Order_Code_Digikey: 644-1367

## Nets that join several sheets
3V3: Designator/ETHERNET (L2_ETHERNET.2), Designator/DRIVERS (L2_DRIVERS.2), USB (L1#1.2), RS-485 (L1#2.2)
GND: Designator/ETHERNET (26 pins), scheme (41 pins), Designator/DRIVERS (26 pins), USB (22 pins), RS-485 (22 pins)
SHGND: Designator/ETHERNET (5 pins), Designator/DRIVERS (5 pins), USB (5 pins), RS-485 (5 pins)
VDD: Designator/ETHERNET (7 pins), Designator/DRIVERS (7 pins), USB (7 pins), RS-485 (7 pins)
NetR39_1: Designator/ETHERNET (R62_ETHERNET.1 U12_ETHERNET.12), Designator/DRIVERS (R62_DRIVERS.1 U12_DRIVERS.12), USB (R39.1 U9.12), RS-485 (R47#2.1 U15.12)
NetR41#2_1: Designator/ETHERNET (R76_ETHERNET.1), Designator/DRIVERS (R76_DRIVERS.1), USB (R53#1.1), RS-485 (R41#2.1)
NetR44#2_1: Designator/ETHERNET (R68_ETHERNET.1), Designator/DRIVERS (R68_DRIVERS.1), USB (R45#1.1), RS-485 (R44#2.1)
NetR45#2_1: Designator/ETHERNET (R69_ETHERNET.1), Designator/DRIVERS (R69_DRIVERS.1), USB (R46#1.1), RS-485 (R45#2.1)
NetR49#2_1: Designator/ETHERNET (R77_ETHERNET.1), Designator/DRIVERS (R77_DRIVERS.1), USB (R54#1.1), RS-485 (R49#2.1)
NetSB1_1: Designator/ETHERNET (SB4_ETHERNET.1), Designator/DRIVERS (SB4_DRIVERS.1), USB (SB1.1), RS-485 (SB74.1)
NetU9_13: Designator/ETHERNET (U12_ETHERNET.13), Designator/DRIVERS (U12_DRIVERS.13), USB (U9.13), RS-485 (U15.13)
NetU9_16: Designator/ETHERNET (U12_ETHERNET.16), Designator/DRIVERS (U12_DRIVERS.16), USB (U9.16), RS-485 (U15.16)
NetU9_17: Designator/ETHERNET (U12_ETHERNET.17), Designator/DRIVERS (U12_DRIVERS.17), USB (U9.17), RS-485 (U15.17)
NetU9_18: Designator/ETHERNET (U12_ETHERNET.18), Designator/DRIVERS (U12_DRIVERS.18), USB (U9.18), RS-485 (U15.18)

## Assembly variants
Production: all parts fitted